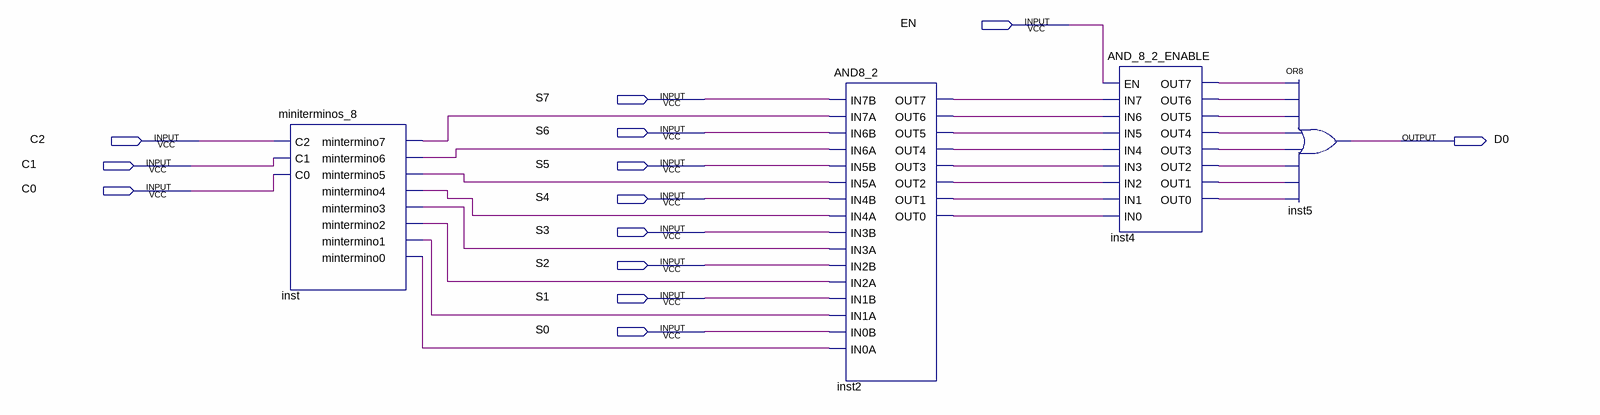
[diagram p0: schematic sheet]
// Quartus schematic mux8_1.bdf as structural Verilog: 4 symbols, 13 pins
module mux8_1 (
  input  EN,
  input  S7,
  input  S6,
  input  C2,
  input  C1,
  input  S5,
  input  C0,
  input  S4,
  input  S3,
  input  S2,
  input  S1,
  input  S0,
  output D0
);

  wire inst2_out0, inst2_out1, inst2_out2, inst2_out3, inst2_out4, inst2_out5, inst2_out6, inst2_out7,
       inst4_out0, inst4_out1, inst4_out2, inst4_out3, inst4_out4, inst4_out5, inst4_out6, inst4_out7,
       inst_mintermino0, inst_mintermino1, inst_mintermino2, inst_mintermino3, inst_mintermino4,
       inst_mintermino5, inst_mintermino6, inst_mintermino7;

  miniterminos_8 inst (
    .C2(C2), .C1(C1), .C0(C0), .mintermino7(inst_mintermino7), .mintermino6(inst_mintermino6),
    .mintermino5(inst_mintermino5), .mintermino4(inst_mintermino4), .mintermino3(inst_mintermino3),
    .mintermino2(inst_mintermino2), .mintermino1(inst_mintermino1), .mintermino0(inst_mintermino0));
  AND8_2 inst2 (
    .IN7B(S7), .IN7A(inst_mintermino7), .IN6B(S6), .IN6A(inst_mintermino6), .IN5B(S5),
    .IN5A(inst_mintermino5), .IN4B(S4), .IN4A(inst_mintermino4), .IN3B(S3), .IN3A(inst_mintermino3),
    .IN2B(S2), .IN2A(inst_mintermino2), .IN1B(S1), .IN1A(inst_mintermino1), .IN0B(S0),
    .IN0A(inst_mintermino0), .OUT7(inst2_out7), .OUT6(inst2_out6), .OUT5(inst2_out5), .OUT4(inst2_out4),
    .OUT3(inst2_out3), .OUT2(inst2_out2), .OUT1(inst2_out1), .OUT0(inst2_out0));
  AND_8_2_ENABLE inst4 (
    .EN(EN), .IN7(inst2_out7), .IN6(inst2_out6), .IN5(inst2_out5), .IN4(inst2_out4), .IN3(inst2_out3),
    .IN2(inst2_out2), .IN1(inst2_out1), .IN0(inst2_out0), .OUT7(inst4_out7), .OUT6(inst4_out6),
    .OUT5(inst4_out5), .OUT4(inst4_out4), .OUT3(inst4_out3), .OUT2(inst4_out2), .OUT1(inst4_out1),
    .OUT0(inst4_out0));
  or inst5 (D0, inst4_out7, inst4_out6, inst4_out5, inst4_out4, inst4_out3, inst4_out2, inst4_out1, inst4_out0);
endmodule
